# EAGLE design AS91-Rel8TstAd-01 (EAGLE 7.7.0)
DATE_CHECKED: 2020-10-12; DATE_DRAWN: 2020-10-11; DATE_RELEASED: 2020-10-12; DRAWING_NUMBER: ASR_HW0026_REL8TSTAD_XXX_DRW_A; GLOBAL_TITLE: Generic Relay Test Adapter with 8 Relays; NAME_CHECKED: A. Schröder; NAME_DRAWN: A. Lindmeier; NAME_RELEASED: G. Hemmel; PROJECT_NAME: Rel8TstAd; PROJECT_NUMBER: HW0026; REV: 01; SUB_TITLE: Relay Box with ATXMEGA
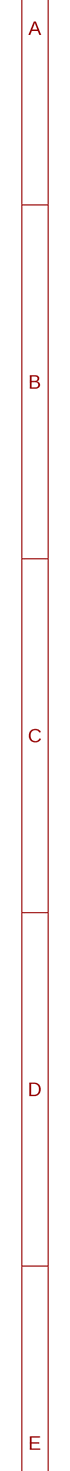
[diagram p0: schematic, sheet 1, part 1 of 2]
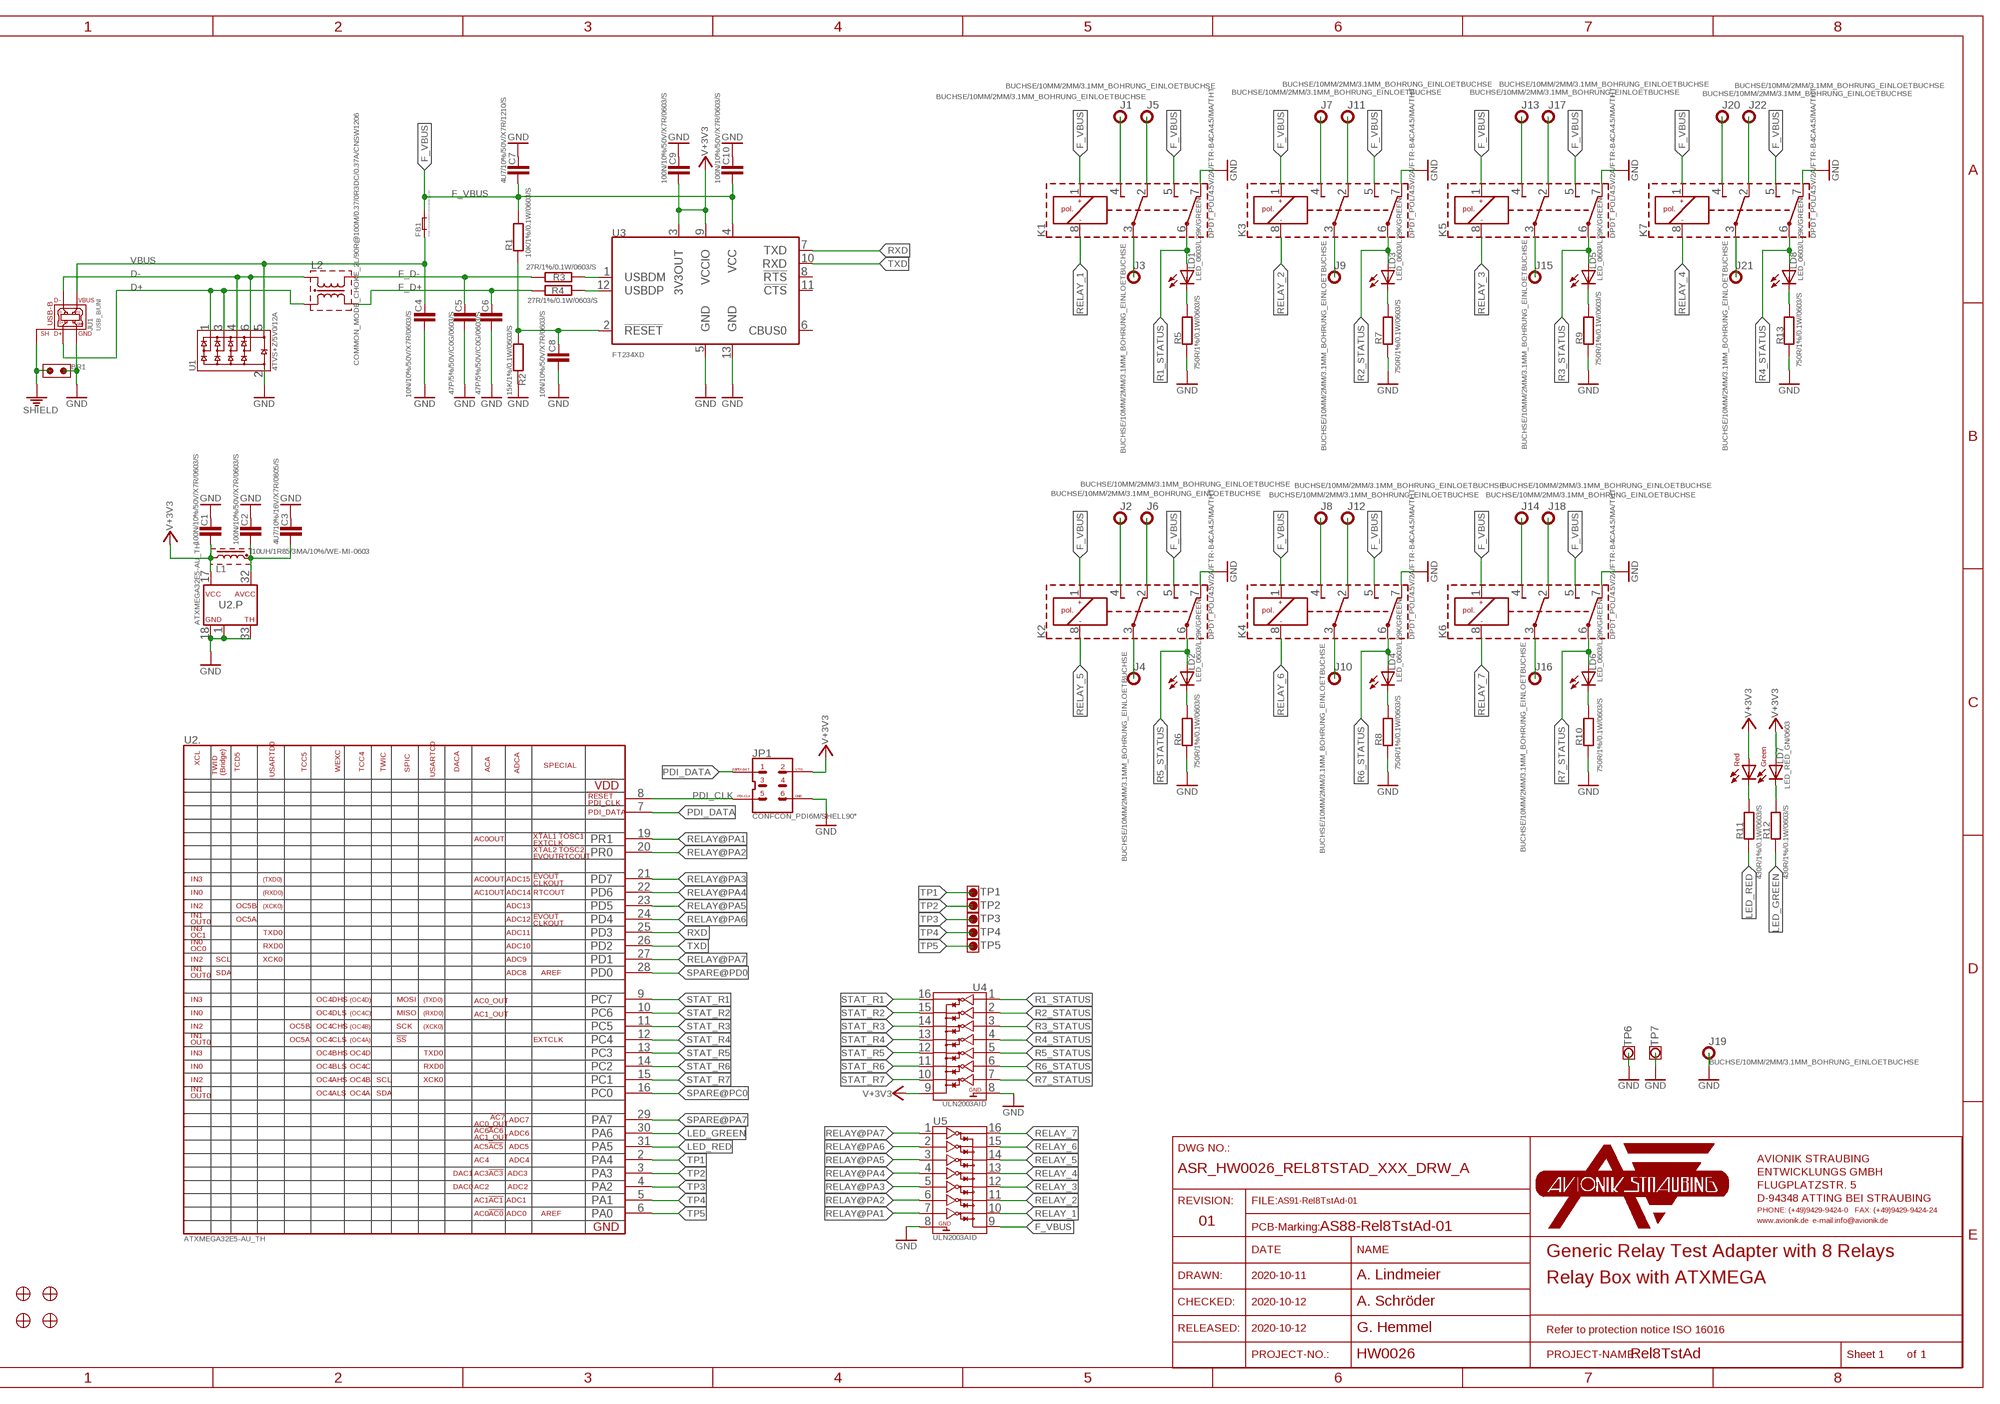
[diagram p1: schematic, sheet 1, part 2 of 2]

## Parts
BR1  BRIDGE_OPEN/SOLDER  [SOLDER_OPEN]
C1  100N/10%/50V/X7R/0603/S  [C0603_STD]
C2  100N/10%/50V/X7R/0603/S  [C0603_STD]
C3  4U7/10%/16V/X7R/0805/S  [C0805_STD]
C4  10N/10%/50V/X7R/0603/S  [C0603_STD]
C5  47P/5%/50V/C0G/0603/S  [C0603_STD]
C6  47P/5%/50V/C0G/0603/S  [C0603_STD]
C7  4U7/10%/50V/X7R/1210/S  [C1210_STD]
C8  10N/10%/50V/X7R/0603/S  [C0603_STD]
C9  100N/10%/50V/X7R/0603/S  [C0603_STD]
C10  100N/10%/50V/X7R/0603/S  [C0603_STD]
DRAWING_FRAME1  DIN_A3LOC_PCBMARK_ASR/TOP/STOP/0.8  [FRAME_REVISION_TOP_STOP_0.8]
FB1  FB/WE-CBF/742792620/DC0R15/0.5A/WE/CBF0603  [WE_CBF_0603]
J1  BUCHSE/10MM/2MM/3.1MM_BOHRUNG_EINLOETBUCHSE  [BUCHSE2MM_PCB3.1MMDRILL]
J2  BUCHSE/10MM/2MM/3.1MM_BOHRUNG_EINLOETBUCHSE  [BUCHSE2MM_PCB3.1MMDRILL]
J3  BUCHSE/10MM/2MM/3.1MM_BOHRUNG_EINLOETBUCHSE  [BUCHSE2MM_PCB3.1MMDRILL]
J4  BUCHSE/10MM/2MM/3.1MM_BOHRUNG_EINLOETBUCHSE  [BUCHSE2MM_PCB3.1MMDRILL]
J5  BUCHSE/10MM/2MM/3.1MM_BOHRUNG_EINLOETBUCHSE  [BUCHSE2MM_PCB3.1MMDRILL]
J6  BUCHSE/10MM/2MM/3.1MM_BOHRUNG_EINLOETBUCHSE  [BUCHSE2MM_PCB3.1MMDRILL]
J7  BUCHSE/10MM/2MM/3.1MM_BOHRUNG_EINLOETBUCHSE  [BUCHSE2MM_PCB3.1MMDRILL]
J8  BUCHSE/10MM/2MM/3.1MM_BOHRUNG_EINLOETBUCHSE  [BUCHSE2MM_PCB3.1MMDRILL]
J9  BUCHSE/10MM/2MM/3.1MM_BOHRUNG_EINLOETBUCHSE  [BUCHSE2MM_PCB3.1MMDRILL]
J10  BUCHSE/10MM/2MM/3.1MM_BOHRUNG_EINLOETBUCHSE  [BUCHSE2MM_PCB3.1MMDRILL]
J11  BUCHSE/10MM/2MM/3.1MM_BOHRUNG_EINLOETBUCHSE  [BUCHSE2MM_PCB3.1MMDRILL]
J12  BUCHSE/10MM/2MM/3.1MM_BOHRUNG_EINLOETBUCHSE  [BUCHSE2MM_PCB3.1MMDRILL]
J13  BUCHSE/10MM/2MM/3.1MM_BOHRUNG_EINLOETBUCHSE  [BUCHSE2MM_PCB3.1MMDRILL]
J14  BUCHSE/10MM/2MM/3.1MM_BOHRUNG_EINLOETBUCHSE  [BUCHSE2MM_PCB3.1MMDRILL]
J15  BUCHSE/10MM/2MM/3.1MM_BOHRUNG_EINLOETBUCHSE  [BUCHSE2MM_PCB3.1MMDRILL]
J16  BUCHSE/10MM/2MM/3.1MM_BOHRUNG_EINLOETBUCHSE  [BUCHSE2MM_PCB3.1MMDRILL]
J17  BUCHSE/10MM/2MM/3.1MM_BOHRUNG_EINLOETBUCHSE  [BUCHSE2MM_PCB3.1MMDRILL]
J18  BUCHSE/10MM/2MM/3.1MM_BOHRUNG_EINLOETBUCHSE  [BUCHSE2MM_PCB3.1MMDRILL]
J19  BUCHSE/10MM/2MM/3.1MM_BOHRUNG_EINLOETBUCHSE  [BUCHSE2MM_PCB3.1MMDRILL]
J20  BUCHSE/10MM/2MM/3.1MM_BOHRUNG_EINLOETBUCHSE  [BUCHSE2MM_PCB3.1MMDRILL]
J21  BUCHSE/10MM/2MM/3.1MM_BOHRUNG_EINLOETBUCHSE  [BUCHSE2MM_PCB3.1MMDRILL]
J22  BUCHSE/10MM/2MM/3.1MM_BOHRUNG_EINLOETBUCHSE  [BUCHSE2MM_PCB3.1MMDRILL]
JP1  CONFCON_PDI6M/SHELL90°  [PH2X3_WSL_SHELL_90°]
JU1  USB_B/UNI  [USB-B-BUCHSE-LP]
K1  DPDT_POL/4.5V/2A/FTR-B4CA4.5/MA/THT  [FTR-B4]
K2  DPDT_POL/4.5V/2A/FTR-B4CA4.5/MA/THT  [FTR-B4]
K3  DPDT_POL/4.5V/2A/FTR-B4CA4.5/MA/THT  [FTR-B4]
K4  DPDT_POL/4.5V/2A/FTR-B4CA4.5/MA/THT  [FTR-B4]
K5  DPDT_POL/4.5V/2A/FTR-B4CA4.5/MA/THT  [FTR-B4]
K6  DPDT_POL/4.5V/2A/FTR-B4CA4.5/MA/THT  [FTR-B4]
K7  DPDT_POL/4.5V/2A/FTR-B4CA4.5/MA/THT  [FTR-B4]
L1  10UH/1R85/3MA/10%/WE-MI-0603  [WE-MI_0603]
L2  COMMON_MODE_CHOKE_2L/90R@100M/0.37/0R3DC/0.37A/CNSW1206  [WUERTH_CNSW_1206]
LD1  LED_0603/L29K/GREEN  [CHIPLED0603SMALL]
LD2  LED_0603/L29K/GREEN  [CHIPLED0603SMALL]
LD3  LED_0603/L29K/GREEN  [CHIPLED0603SMALL]
LD4  LED_0603/L29K/GREEN  [CHIPLED0603SMALL]
LD5  LED_0603/L29K/GREEN  [CHIPLED0603SMALL]
LD6  LED_0603/L29K/GREEN  [CHIPLED0603SMALL]
LD7  LED_RED_GN/0603  [DUOLED_0603]
LD8  LED_0603/L29K/GREEN  [CHIPLED0603SMALL]
PCB1  TEKO_MOD_P2  [BOARD_TEKO_MOD_P2_UP]
R1  10K/1%/0.1W/0603/S  [R0603_STD]
R2  15K/1%/0.1W/0603/S  [R0603_STD]
R3  27R/1%/0.1W/0603/S  [R0603_STD]
R4  27R/1%/0.1W/0603/S  [R0603_STD]
R5  750R/1%/0.1W/0603/S  [R0603_STD]
R6  750R/1%/0.1W/0603/S  [R0603_STD]
R7  750R/1%/0.1W/0603/S  [R0603_STD]
R8  750R/1%/0.1W/0603/S  [R0603_STD]
R9  750R/1%/0.1W/0603/S  [R0603_STD]
R10  750R/1%/0.1W/0603/S  [R0603_STD]
R11  430R/1%/0.1W/0603/S  [R0603_STD]
R12  430R/1%/0.1W/0603/S  [R0603_STD]
R13  750R/1%/0.1W/0603/S  [R0603_STD]
TP1  TESTPAD_ROUND/1.0MM  [TP_ROUND_SMD_1MM]
TP2  TESTPAD_ROUND/1.0MM  [TP_ROUND_SMD_1MM]
TP3  TESTPAD_ROUND/1.0MM  [TP_ROUND_SMD_1MM]
TP4  TESTPAD_ROUND/1.0MM  [TP_ROUND_SMD_1MM]
TP5  TESTPAD_ROUND/1.0MM  [TP_ROUND_SMD_1MM]
TP6  TESTPOINT_1/OCT_0.8  [TP_OCT_0.8_DRILL]
TP7  TESTPOINT_1/OCT_0.8  [TP_OCT_0.8_DRILL]
U1  4TVS+Z/5V0/12A  [SOT23-6L]
U2  ATXMEGA32E5-AU_TH  [TQFP32A_THGND]
U3  FT234XD  [FT234XD]
U4  ULN2003AID  [SO16]
U5  ULN2003AID  [SO16]

## Nets
D+: JU1.3(D+) L2.1(L2_A) U1.1(IO1) U1.3(IO2)
D-: JU1.2(D-) L2.4(L1_A) U1.4(IO3) U1.6(IO4)
F_D+: C6.1 L2.2(L2_B) R4.1
F_D-: C5.1 L2.3(L1_B) R3.1
F_VBUS: C7.2 C10.2 FB1.2 K1.1(K+) K1.5(NO2) K2.1(K+) K2.5(NO2) K3.1(K+) K3.5(NO2) K4.1(K+) K4.5(NO2) K5.1(K+) K5.5(NO2) K6.1(K+) K6.5(NO2) K7.1(K+) K7.5(NO2) R1.2 U3.4(VCC) U5.9(CFW)
GND: BR1.CENT C1.1 C2.1 C3.1 C4.2 C5.2 C6.2 C7.1 C8.2 C9.1 C10.1 J19.1 JP1.6(GND) JU1.4(GND) K1.7(NC2) K2.7(NC2) K3.7(NC2) K4.7(NC2) K5.7(NC2) K6.7(NC2) K7.7(NC2) R2.1 R5.1 R6.1 R7.1 R8.1 R9.1 R10.1 R13.1 TP6.A TP7.A U1.2(GND) U2.1(.P:GND) U2.18(.P:GND) U2.33(.P:GND) U3.5(GND) U3.13(GND) U4.8(GND) U5.8(GND)
LED_GREEN: R12.1 U2.30(.:PA6)
LED_RED: R11.1 U2.31(.:PA5)
N$1: J7.1 K3.4(NO1)
N$3: J11.1 K3.2(NC1)
N$4: J1.1 K1.4(NO1)
N$5: J9.1 K3.3(COM1)
N$6: J13.1 K5.4(NO1)
N$7: J17.1 K5.2(NC1)
N$8: J15.1 K5.3(COM1)
N$9: J20.1 K7.4(NO1)
N$12: LD7.3(C_GN) R12.2
N$13: R3.2 U3.1(USBDM)
N$14: R4.2 U3.12(USBDP)
N$15: J2.1 K2.4(NO1)
N$16: J5.1 K1.2(NC1)
N$17: C8.1 R1.1 R2.2 U3.2(!RESET)
N$18: LD7.4(C_RED) R11.2
N$19: J3.1 K1.3(COM1)
N$20: J22.1 K7.2(NC1)
N$21: J21.1 K7.3(COM1)
N$23: J6.1 K2.2(NC1)
N$24: J4.1 K2.3(COM1)
N$25: J8.1 K4.4(NO1)
N$26: J12.1 K4.2(NC1)
N$27: J10.1 K4.3(COM1)
N$28: J14.1 K6.4(NO1)
N$29: J18.1 K6.2(NC1)
N$30: J16.1 K6.3(COM1)
N$36: LD1.C R5.2
N$37: LD3.C R7.2
N$38: LD5.C R9.2
N$39: LD8.C R13.2
N$40: LD6.C R10.2
N$41: LD4.C R8.2
N$42: LD2.C R6.2
N$50: C2.2 C3.2 L1.1 U2.32(.P:AVCC)
PDI_CLK: JP1.5(PDI_CLK) U2.8(.:PDI_CLK/!RESET)
PDI_DATA: JP1.1(PDI_DATA) U2.7(.:PDI_DATA)
R1_STATUS: K1.6(COM2) LD1.A U4.1(IN1)
R2_STATUS: K3.6(COM2) LD3.A U4.2(IN2)
R3_STATUS: K5.6(COM2) LD5.A U4.3(IN3)
R4_STATUS: K7.6(COM2) LD8.A U4.4(IN4)
R5_STATUS: K2.6(COM2) LD2.A U4.5(IN5)
R6_STATUS: K4.6(COM2) LD4.A U4.6(IN6)
R7_STATUS: K6.6(COM2) LD6.A U4.7(IN7)
RELAY@PA1: U2.19(.:PR1) U5.7(IN7)
RELAY@PA2: U2.20(.:PR0) U5.6(IN6)
RELAY@PA3: U2.21(.:PD7) U5.5(IN5)
RELAY@PA4: U2.22(.:PD6) U5.4(IN4)
RELAY@PA5: U2.23(.:PD5) U5.3(IN3)
RELAY@PA6: U2.24(.:PD4) U5.2(IN2)
RELAY@PA7: U2.27(.:PD1) U5.1(IN1)
RELAY_1: K1.8(K-) U5.10(OUT7)
RELAY_2: K3.8(K-) U5.11(OUT6)
RELAY_3: K5.8(K-) U5.12(OUT5)
RELAY_4: K7.8(K-) U5.13(OUT4)
RELAY_5: K2.8(K-) U5.14(OUT3)
RELAY_6: K4.8(K-) U5.15(OUT2)
RELAY_7: K6.8(K-) U5.16(OUT1)
RXD: U2.25(.:PD3) U3.7(TXD)
SHIELD: BR1.A JU1.SH1 JU1.SH2(SH1)
SPARE@PA7: U2.29(.:PA7)
SPARE@PC0: U2.16(.:PC0)
SPARE@PD0: U2.28(.:PD0)
STAT_R1: U2.9(.:PC7) U4.16(OUT1)
STAT_R2: U2.10(.:PC6) U4.15(OUT2)
STAT_R3: U2.11(.:PC5) U4.14(OUT3)
STAT_R4: U2.12(.:PC4) U4.13(OUT4)
STAT_R5: U2.13(.:PC3) U4.12(OUT5)
STAT_R6: U2.14(.:PC2) U4.11(OUT6)
STAT_R7: U2.15(.:PC1) U4.10(OUT7)
TP1: TP1.1 U2.2(.:PA4)
TP2: TP2.1 U2.3(.:PA3)
TP3: TP3.1 U2.4(.:PA2)
TP4: TP4.1 U2.5(.:PA1)
TP5: TP5.1 U2.6(.:PA0)
TXD: U2.26(.:PD2) U3.10(RXD)
V+3V3: C1.2 C9.2 JP1.2(VTG) L1.2 LD7.1(A_GN) LD7.2(A_RED) U2.17(.P:VCC) U3.3(3V3OUT) U3.9(VCCIO) U4.9(CFW)
VBUS: C4.1 FB1.1 JU1.1(VBUS) U1.5(VDD)
Unconnected: PCB1.P$1 PCB1.P$2 PCB1.P$3 PCB1.P$4 U3.6(CBUS0) U3.8(!RTS) U3.11(!CTS)

## Library data of the parts
BR1 = StdConnBridgeJumpers:BRIDGE_OPEN: Bridge, normally open; AVSR-NR: Integral part of PCB
C1 C2 C9 C10 = CapCeramic:100N: Capacitor, 100nF; AVSR-NR: 1C00603-00002; H_MAX: 0.90mm; MFR: Kemet, C0603C104K5RACTU
C3 = CapCeramic:4U7: Capacitor, 4.7 uF; AVSR-NR: 1C00805-00016; H_MAX: 1.40mm; MFR: Kemet, C0805C475K4RACAUTO
C4 C8 = CapCeramic:10N: Capacitor, 10nF; AVSR-NR: 1C00603-00001; H_MAX: 0.90mm; MFR: Kemet, C0603C103K5RACTU
C5 C6 = CapCeramic:47P: Capacitor, 47pF; AVSR-NR: 1C00603-00030; H_MAX: 0.90mm; MFR: Kemet, C0603C470J5GACAUTO
C7 = CapCeramic:4U7: Capacitor, 4.7 uF; AVSR-NR: 1C01210-00004; H_MAX: 2.70mm; MFR: Kemet, C1210X475K5RACTU
DRAWING_FRAME1 = AvsrEntwicklungsGmbHDrawingFrames:DIN_A3LOC_PCBMARK_ASR: A3 drawing frame with location grid and pcb marking field in the document field; PCB_MARKING: AS88-Rel8TstAd-01
FB1 = StdInductorEmiFilters:FB: Ferrit Bead Manufacturer Datasheet Links Würth WE-CBF 742792641 <http://katalog.we-online.de/pbs/datasheet/742792641.pdf> 742792620 <http://katalog.we-online.de/pbs/datasheet/742792620.pdf> Würth WE-CBF Type Wide Band 742792062 <http://katalog.we-online.de/pbs/datasheet/742792062.pdf> Würth WE-CBF Type High Current 742792510 <http://katalog.we-online.de/pbs/datasheet/742792510.pdf> Würth WE-MPSB 74279228260 <http://katalog.we-online.de/pbs/datasheet/74279228260.pdf> 74279221100 <http://katalog.we-online.de/pbs/datasheet/74279221100.pdf>; AVSR-NR: 1L6CBF0-00001; DISTRI: Farnell, 1800350RL; H_MAX: 1.00mm; MFR: Würth, 742792620
J1-J22 = StdConnBananaPlug:BUCHSE: Buchsen; AVSR-NR: 2JR0000-00012; MFR: MC/Stäubli, LB2-D
JP1 = StdMicrocontollerAtmelAT:CONFCON_PDI6M: ATMEL config/debug connector, combined SPI/PDI-Interface; AVSR-NR: 2JPH000-00019; H_MAX: 10 mm; MFR: Molex, 90130-3106
JU1 = StdConnUsb:USB_B; AVSR-NR: 1JP0000-00015; MFR: Amphenol, 61729-0010BLF
K1-K7 = StdElMechRelay:DPDT_POL: Relay, polarized, double pole, double throw (2xUm); AVSR-NR: 1K00000-00001; H_MAX: 9.30 mm; MFR: Fujitsu-Takamisawa, FTR-B4CA4.5
L1 = StdInductors:10UH: Inductor, 10uH; AVSR-NR: 1L0WEMI-00001; MFR: Würth, 7447968
L2 = StdInductorEmiFilters:COMMON_MODE_CHOKE_2L: Current Compensated Chokes; AVSR-NR: 1L3CNSW-00002; H_MAX: 2.00mm; MFR: Würth, 744232090
LD1-LD6 LD8 = StdOptronicLED:LED_0603: LED, 0603 package; AVSR-NR: 1DLED00-00005; H_MAX: 0.90mm; MFR: Osram, LG L29K-F2J1-24-Z
LD7 = StdOptronicLED:LED_RED_GN: Duo-LED, Red/Green; AVSR-NR: 1DLED00-00011; MFR: Broadcom/Avago, HSMF-C165
PCB1 = PS_AVSR_TESTBOXEN:TEKO_MOD_P2; AVSR-NR: 3A00000-00026; MFR: TEKO, P2.10
R1 = StdResistorsFixed:10K: Resistor 10 kOhm; AVSR-NR: 1R00603-00097; H_MAX: 0.5 mm; MFR: Vishay, CRCW060310K0FKEA
R2 = StdResistorsFixed:15K: Resistor 15 kOhm; AVSR-NR: 1R00603-00101; H_MAX: 0.5mm; MFR: Vishay, CRCW060315K0FKEA
R3 R4 = StdResistorsFixed:27R: Resistor 27 Ohm; AVSR-NR: 1R00603-00300; H_MAX: 0.5mm; MFR: Vishay, CRCW060327R0FKEA
R5-R10 R13 = StdResistorsFixed:750R: Resistor 750 Ohm; AVSR-NR: 1R00603-00228; DISTRI: Bürklin, 07E584; H_MAX: 0.5mm
R11 R12 = StdResistorsFixed:430R: Resistor 430 Ohm; AVSR-NR: 1R00603-00064; H_MAX: 0.5mm; MFR: Vishay, CRCW0603430RFKEA
TP1-TP5 = StdConnTestpoints:TESTPAD_ROUND: Testpad, round; AVSR-NR: Integral part of PCB
TP6 TP7 = StdConnTestpoints:TESTPOINT_1: Single Testpoint; AVSR-NR: Integral part of PCB
U1 = StdProtectionDevices:4TVS+Z; AVSR-NR: 1DWETVS-00022; H_MAX: 1.45mm; MFR: Würth, 824015
U2 = StdMicrocontollerAtmelAT:ATXMEGA*E5: Atmel ATxmega E5 series; AVSR-NR: 1U00UC0-00007; H_MAX: 1.20mm; MFR: Microchip/Atmel, ATXMEGA32E5-AU
U3 = StdInterfaceUSB:FT234XD: FT234XS USB to basic UART IC; AVSR-NR: 6P00000-00034; H_MAX: 0.8mm; MFR: FTDI, FT234XD-R
U4 U5 = StdDriverArrays:ULN2003: Driver Array, 7 Drivers, 5V/TTL/CMOS; AVSR-NR: 1U00HC0-00033; H_MAX: 1.75 mm; MFR: TI, ULN2003AID

## Net classes
1 shield: clearance 0.5 mm

## Board
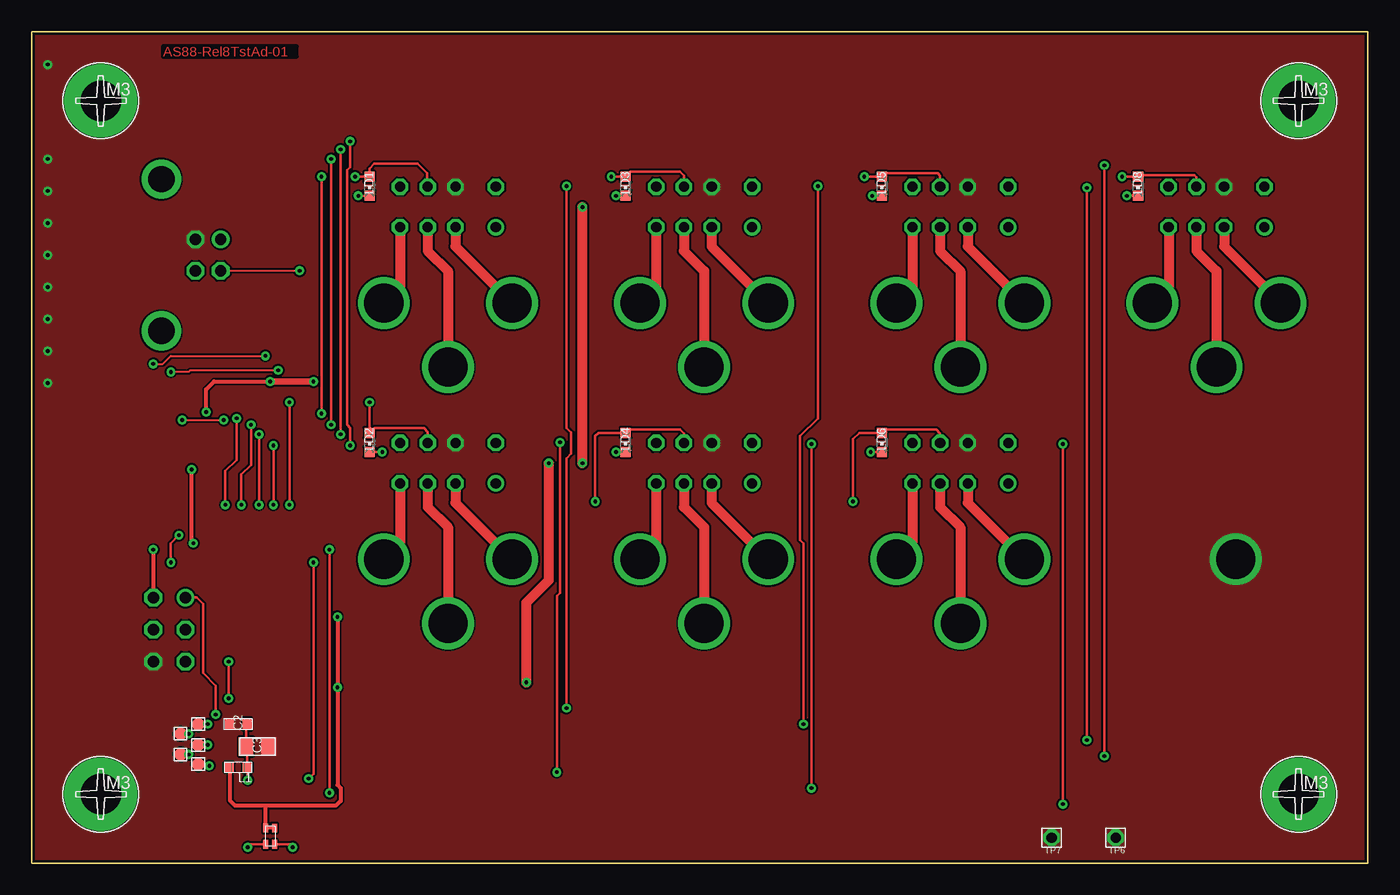
[diagram p2: board, top side]
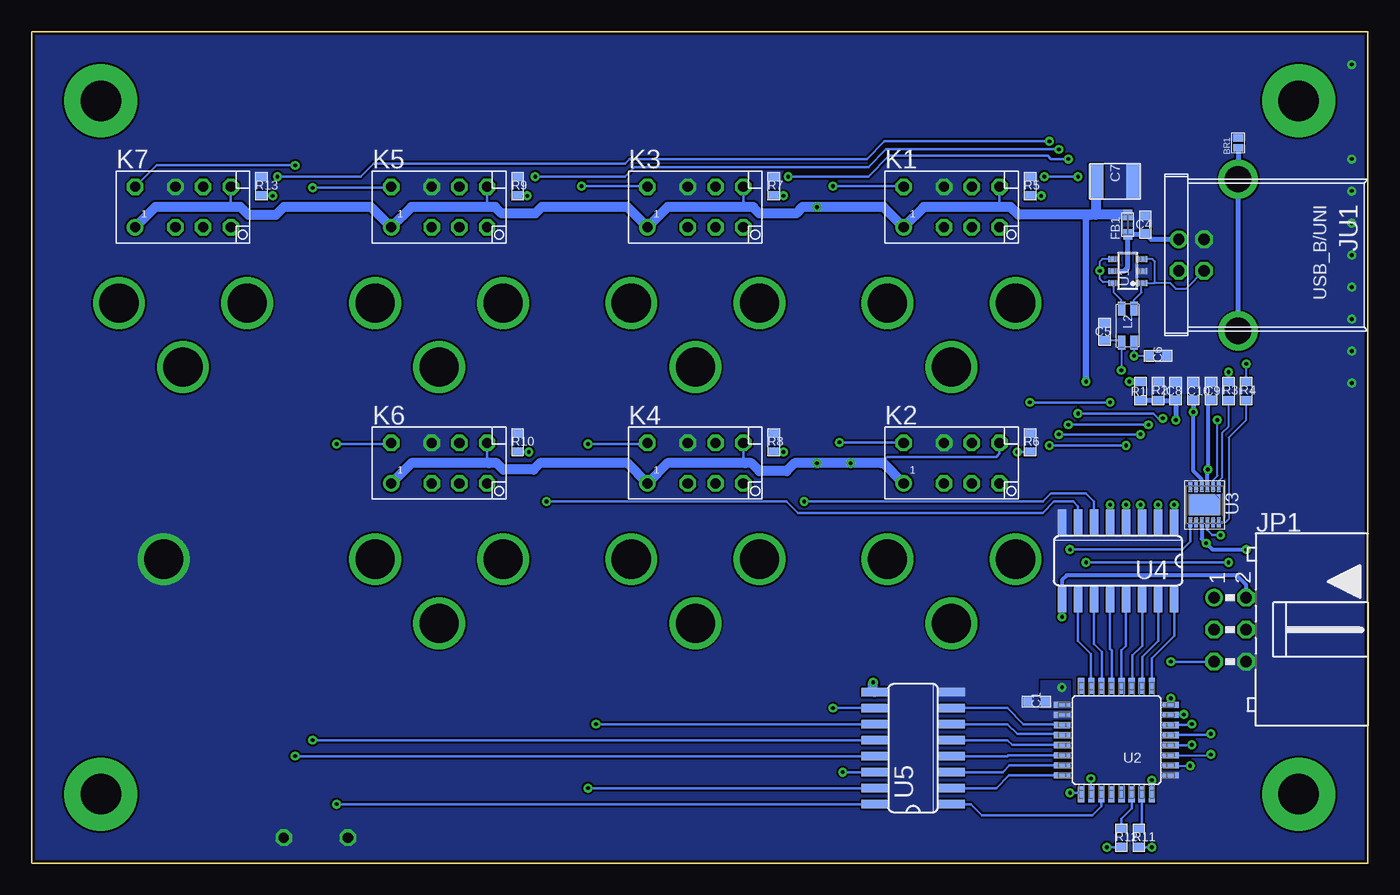
[diagram p3: board, bottom side, seen from below]

Size 106 x 66 mm. Coordinates in mm from the lower left corner, seen from the top.
Copper layers (1*16): Top 0.035mm / dielectric 1.5mm / Bottom 0.035mm
Design rules "BetaLayout_2Layer1.6mm0.3mmSupr": minimum track width 0.15mm, minimum drill 0.3mm, track to track 0.15mm, track to pad 0.15mm, pad to pad 0.15mm, via to via 0.15mm, smd to smd 0.15mm, copper to edge 0.2mm, drill to drill 0.5mm, minimum pad ring 10mil, minimum via ring 8mil, stop-mask expansion 4mil, vias tented up to drill 0.301mm, thermal gap 10mil

### Footprints (pad centres in the part's own frame; a part is rotated, then mirrored left to right if it is on the bottom)
SOLDER_OPEN = smd 0.6 x 0.8: A -0.4,0; CENT 0.4,0
C0603_STD = smd 0.7 x 0.9: 1 -0.7,0; 2 0.7,0
C0805_STD = smd 1.15 x 1.45: 1 -0.9,0; 2 0.9,0
C1210_STD = smd 1.15 x 2.7: 1 -1.5,0; 2 1.5,0
WE_CBF_0603 = smd 0.85 x 0.7: 1 -0.775,0; 2 0.775,0
BUCHSE2MM_PCB3.1MMDRILL = drill 3.1 pad 4.1: 1 0,0
PH2X3_WSL_SHELL_90° = drill 0.9: 1 -2.54,-1.27 | drill 0.9 octagon: 2 -2.54,1.27; 3 0,-1.27; 4 0,1.27; 5 2.54,-1.27; 6 2.54,1.27
USB-B-BUCHSE-LP = drill 0.9: 1 -1.25,-4.71 | drill 0.9 octagon: 2 1.25,-4.71; 3 1.25,-2.71; 4 -1.25,-2.71 | drill 2.1: SH1 -6.02,0; SH2 6.02,0
FTR-B4 = drill 0.8: 1 -3.8,-1.6 | drill 0.8 octagon: 2 -0.6,-1.6; 3 1.6,-1.6; 4 3.8,-1.6; 5 3.8,1.6; 6 1.6,1.6; 7 -0.6,1.6; 8 -3.8,1.6
WE-MI_0603 = smd 0.75 x 0.7: 1 -0.725,0; 2 0.725,0
WUERTH_CNSW_1206 = smd 1.1 x 0.6: 1 -1.35,0.5; 2 1.35,0.5; 3 1.35,-0.5; 4 -1.35,-0.5
CHIPLED0603SMALL = smd 0.8 x 0.8: A 0,-0.75; C 0,0.75
DUOLED_0603 = smd 0.7 x 0.4: 1 -0.65,0.35; 2 -0.65,-0.35; 3 0.65,0.35; 4 0.65,-0.35
BOARD_TEKO_MOD_P2_UP = drill 3.2 pad 5.8: P$1 101,6; P$2 6,61; P$3 6,6; P$4 101,61
R0603_STD = smd 0.7 x 0.9: 1 -0.75,0; 2 0.75,0
TP_ROUND_SMD_1MM = smd 1 x 1: 1 0,0
TP_OCT_0.8_DRILL = drill 0.8 octagon: A 0,0
SOT23-6L = smd 0.5 x 0.9: 1 -0.95,-1.1; 2 0,-1.1; 3 0.95,-1.1; 4 0.95,1.1; 5 0,1.1; 6 -0.95,1.1
TQFP32A_THGND = smd 1.3 x 0.5: 1 -4.3,2.8; 2 -4.3,2; 3 -4.3,1.2; 4 -4.3,0.4; 5 -4.3,-0.4; 6 -4.3,-1.2; 7 -4.3,-2; 8 -4.3,-2.8; 17 4.3,-2.8; 18 4.3,-2; 19 4.3,-1.2; 20 4.3,-0.4; 21 4.3,0.4; 22 4.3,1.2; 23 4.3,2; 24 4.3,2.8; 33 -4.3,2.8 | smd 0.5 x 1.3: 9 -2.8,-4.3; 10 -2,-4.3; 11 -1.2,-4.3; 12 -0.4,-4.3; 13 0.4,-4.3; 14 1.2,-4.3; 15 2,-4.3; 16 2.8,-4.3; 25 2.8,4.3; 26 2,4.3; 27 1.2,4.3; 28 0.4,4.3; 29 -0.4,4.3; 30 -1.2,4.3; 31 -2,4.3; 32 -2.8,4.3
FT234XD = smd 0.8 x 0.3: 1 -1.4,1.125; 2 -1.4,0.675; 3 -1.4,0.225; 4 -1.4,-0.225; 5 -1.4,-0.675; 6 -1.4,-1.125; 7 1.4,-1.125; 8 1.4,-0.675; 9 1.4,-0.225; 10 1.4,0.225; 11 1.4,0.675; 12 1.4,1.125 | smd 1.6 x 2.5: 13 0,0
SO16 = smd 0.66 x 2.032: 1 -4.445,-3.073; 2 -3.175,-3.073; 3 -1.905,-3.073; 4 -0.635,-3.073; 5 0.635,-3.073; 6 1.905,-3.073; 7 3.175,-3.073; 8 4.445,-3.073; 9 4.445,3.073; 10 3.175,3.073; 11 1.905,3.073; 12 0.635,3.073; 13 -0.635,3.073; 14 -1.905,3.073; 15 -3.175,3.073; 16 -4.445,3.073

### Placement (x,y rotation side)
BR1  10.3,57.16 90 bottom
C1  26.3,12.84 0 bottom
C2  16.39,11.06 0 top
C3  17.91,9.28 180 top
C4  17.66,50.68 90 bottom
C5  20.88,42.17 90 bottom
C6  16.64,40.27 0 bottom
C7  20.07,54.11 180 bottom
C8  15.25,37.47 90 bottom
C9  12.45,37.47 270 bottom
C10  13.85,37.47 270 bottom
DRAWING_FRAME1  10.42,64.02 0 top
FB1  19.06,50.68 90 bottom
J1  27.95,44.46 270 top
J2  27.95,24.14 180 top
J3  33.03,39.38 270 top
J4  33.03,19.06 180 top
J5  38.11,44.46 270 top
J6  38.11,24.14 180 top
J7  48.27,44.46 0 top
J8  48.27,24.14 180 top
J9  53.35,39.38 0 top
J10  53.35,19.06 180 top
J11  58.43,44.46 0 top
J12  58.43,24.14 180 top
J13  68.59,44.46 0 top
J14  68.59,24.14 180 top
J15  73.67,39.38 0 top
J16  73.67,19.06 180 top
J17  78.75,44.46 0 top
J18  78.75,24.14 180 top
J19  95.51,24.14 90 top
J20  88.91,44.46 180 top
J21  93.99,39.38 180 top
J22  99.07,44.46 180 top
JP1  10.93,18.55 270 bottom
JU1  10.3,48.27 270 bottom
K1  33.03,52.08 0 bottom
K2  33.03,31.76 0 bottom
K3  53.35,52.08 0 bottom
K4  53.35,31.76 0 bottom
K5  73.67,52.08 0 bottom
K6  73.67,31.76 0 bottom
K7  93.99,52.08 0 bottom
L1  16.39,7.63 180 top
L2  19.06,42.68 270 bottom
LD1  26.8,53.73 180 top
LD2  26.8,33.41 180 top
LD3  47.12,53.73 180 top
LD4  47.12,33.41 180 top
LD5  67.44,53.73 180 top
LD6  67.44,33.41 180 top
LD7  18.93,2.17 270 top
LD8  87.77,53.73 180 top
PCB1  -0.5,-0.5 0 top
R1  18.04,37.47 90 bottom
R2  16.64,37.47 270 bottom
R3  11.06,37.47 270 bottom
R4  9.66,37.47 270 bottom
R5  26.8,53.73 270 bottom
R6  26.8,33.41 270 bottom
R7  47.12,53.73 270 bottom
R8  47.12,33.41 270 bottom
R9  67.44,53.73 270 bottom
R10  67.44,33.41 270 bottom
R11  18.17,2.04 270 bottom
R12  19.57,2.04 270 bottom
R13  87.77,53.73 270 bottom
TP1  13.22,7.88 180 top
TP2  11.82,8.64 180 top
TP3  13.22,9.41 180 top
TP4  11.82,10.3 180 top
TP5  13.22,11.06 180 top
TP6  85.99,2.04 180 top
TP7  80.91,2.04 180 top
U1  19.06,47 90 bottom
U2  19.95,9.79 180 bottom
U3  12.96,28.46 270 bottom
U4  19.82,24.01 180 bottom
U5  36.08,9.15 90 bottom

### Tracks (layer width: path | path; a pad name or v marks a point on that pad's centre or on a via)
D+
  Bottom 0.15: L2.1 18.56,44.7 17.96,45.3 U1.1 16.9,46.05 | U1.3 17.09,47.95 16.9,47.76 16.9,46.05 | 16.9,46.05 15.7,46.05 15.25,45.6 14.42,45.6 JU1.3
D-  (via drill 0.3)
  Top 0.15: JU1.2 v21.26,47.02
  Bottom 0.15: L2.4 19.57,44.71 20.16,45.3 U1.6 20.22,46.11 21.01,46.11 21.26,46.36 v21.26,47.02 21.26,47.76 21.08,47.95 U1.4
F_D+  (via drill 0.3)
  Top 0.15: v9.66,39.63 10.42,39.63 11.06,40.27 v18.55,40.27
  Bottom 0.15: 18.56,41.47 L2.2 v18.55,40.27 C6.1 | R4.1 v9.66,39.63
F_D-  (via drill 0.3)
  Top 0.15: v19.57,39.12 12.58,39.12 12.45,39 v11.06,39
  Bottom 0.15: L2.3 | L2.3 19.57,41.47 C5.1 | L2.3 v19.57,39.12 | v11.06,39 R3.1
F_VBUS  (via drill 0.3)
  Top 0.3: v13.85,35.82 13.85,37.6 14.49,38.23 v18.93,38.23
  Top 0.5: v18.93,38.23 v22.36,38.23
  Top 0.8: v43.7,31.76 v43.7,52.08 | v39.25,14.36 39.25,20.71 41.03,22.49 v41.03,31.76
  Bottom 0.2: 28.33,52.08 29.23,52.08 K1.5 | K3.5 49.55,52.34 49.28,52.08 | K5.5 69.87,52.2 69.98,52.08 | K7.5 90.19,52.09 90.18,52.08 | K2.5 29.23,32.51 29.47,32.27 38.11,32.27 38.62,31.76 | K4.5 49.55,31.89 49.41,31.76 | K6.5 69.87,31.89 69.73,31.76
  Bottom 0.3: U3.4 13.19,30.46 13.85,31.12 v13.85,35.82
  Bottom 0.4: R1.2 18.05,38.23 | C10.2 v13.85,35.82
  Bottom 0.5: 18.05,38.23 v18.93,38.23 | v22.36,38.23 22.36,51.08 21.98,51.46
  Bottom 0.8: FB1.2 21.6,51.46 | C7.2 21.6,54.11 21.6,51.46 | 21.6,51.46 21.98,51.46 27.71,51.46 28.33,52.08 35.23,52.08 K1.1 38.43,52.08 v43.7,52.08 44.84,52.08 45.35,51.57 48.27,51.57 48.78,52.08 49.28,52.08 55.55,52.08 K3.1 58.75,52.08 65.54,52.08 66.05,51.57 68.71,51.57 69.22,52.08 69.98,52.08 75.87,52.08 K5.1 79.07,52.08 85.99,52.08 86.62,51.44 88.78,51.44 89.42,52.08 90.18,52.08 96.19,52.08 K7.1 | K2.1 38.43,31.76 38.62,31.76 v41.03,31.76 v43.7,31.76 45.47,31.76 46.11,31.12 48.27,31.12 48.9,31.76 49.41,31.76 55.55,31.76 K4.1 58.75,31.76 65.67,31.76 66.17,31.25 68.59,31.25 69.1,31.76 69.73,31.76 75.87,31.76 K6.1 | U5.9 39.25,13.7 v39.25,14.36
GND  (via drill 0.3)
  other vias: 1.28,38.11 1.28,63.38 1.28,48.27 1.28,45.73 1.28,43.19 1.28,40.65 1.28,50.81 1.28,53.35 1.28,55.89
  pour Bottom (rank 5, no thermals): 105.99,-0.01 105.99,65.99 -0.01,65.99 -0.01,-0.01
  pour Top (rank 5, no thermals): -0.01,-0.01 -0.01,65.99 105.99,65.99 105.99,-0.01
LED_GREEN
  Bottom 0.2: U2.30 18.75,4.38 19.57,3.56 R12.1
LED_RED
  Bottom 0.2: U2.31 17.95,3.01 R11.1
N$1
  Top 0.8: K3.4 49.55,45.74 J7.1
N$3
  Top 0.8: K3.2 53.95,48.94 J11.1
N$4
  Top 0.8: K1.4 29.23,45.74 J1.1
N$5
  Top 0.8: K3.3 51.75,48.6 53.35,47 J9.1
N$6
  Top 0.8: K5.4 69.87,45.74 J13.1
N$7
  Top 0.8: K5.2 74.27,48.94 J17.1
N$8
  Top 0.8: K5.3 72.07,48.6 73.67,47 J15.1
N$9
  Top 0.8: K7.4 90.19,45.74 J20.1
N$12  (via drill 0.3)
  Top 0.2: LD7.3 20.47,1.52 v20.71,1.28
  Bottom 0.2: v20.71,1.28 R12.2
N$13
  Bottom 0.15: U3.1 11.84,30.34 11.57,30.61 11.57,34.17 11.06,34.68 R3.2
N$14
  Bottom 0.15: R4.2 9.66,35.19 11.06,33.79 11.06,27.31 11.31,27.06 U3.12
N$15
  Top 0.8: K2.4 29.23,25.42 J2.1
N$16
  Top 0.8: K1.2 33.63,48.94 J5.1
N$17  (via drill 0.3)
  Top 0.15: v11.95,35.19 v15.25,35.19
  Bottom 0.15: U3.2 12.29,30.4 11.95,30.74 v11.95,35.19 | 15.3,36.72 C8.1
  Bottom 0.4: C8.1 v15.25,35.19 | R1.1 R2.2 15.3,36.72
N$18  (via drill 0.3)
  Top 0.2: LD7.4 17.39,1.52 v17.15,1.28
  Bottom 0.2: v17.15,1.28 R11.2
N$19
  Top 0.8: K1.3 31.43,48.6 33.03,47 J3.1
N$20
  Top 0.8: K7.2 94.59,48.94 J22.1
N$21
  Top 0.8: K7.3 92.39,48.6 93.99,47 J21.1
N$23
  Top 0.8: K2.2 33.63,28.62 J6.1
N$24
  Top 0.8: K2.3 31.43,28.28 33.03,26.68 J4.1
N$25
  Top 0.8: K4.4 49.55,25.42 J8.1
N$26
  Top 0.8: K4.2 53.95,28.62 J12.1
N$27
  Top 0.8: K4.3 51.75,28.28 53.35,26.68 J10.1
N$28
  Top 0.8: K6.4 69.87,25.42 J14.1
N$29
  Top 0.8: K6.2 74.27,28.62 J18.1
N$30
  Top 0.8: K6.3 72.07,28.28 73.67,26.68 J16.1
N$36  (via drill 0.3)
  Top 0.15: v25.92,52.97 R5.2
  Bottom 0.15: R5.2 v25.92,52.98 v25.92,52.97
N$37  (via drill 0.3)
  Top 0.2: R7.2 46.38,52.98 v46.36,52.97
  Bottom 0.2: v46.36,52.97 47.11,52.97 R7.2
N$38  (via drill 0.3)
  Top 0.2: R9.2 66.69,52.98 v66.68,52.97
  Bottom 0.2: v66.68,52.97 67.43,52.97 R9.2
N$39  (via drill 0.3)
  Top 0.2: v86.88,52.97 87.75,52.97 R13.2
  Bottom 0.2: R13.2 v86.89,52.98 v86.88,52.97
N$40  (via drill 0.3)
  Top 0.2: v66.56,32.65 67.43,32.65 R10.2
  Bottom 0.2: R10.2 66.57,32.66 v66.56,32.65
N$41  (via drill 0.3)
  Top 0.2: v46.36,32.65 47.11,32.65 R8.2
  Bottom 0.2: R8.2 46.38,32.66 v46.36,32.65
N$42  (via drill 0.3)
  Top 0.2: R6.2 v27.82,32.65
  Bottom 0.2: v27.82,32.65 R6.2
N$50  (via drill 0.3)
  Top 0.2: v17.15,6.61 17.15,7.59 L1.1 17.12,9.18 C3.2 17.04,9.3 17.04,11 C2.2
  Bottom 0.2: U2.32 v17.15,6.61
PDI_CLK  (via drill 0.3)
  Top 0.2: v15.63,16.01 v15.63,13.09
  Bottom 0.2: JP1.5 v15.63,16.01 | v15.63,13.09 15.63,12.61 U2.8
PDI_DATA  (via drill 0.3)
  Top 0.2: JP1.1 13.09,21.09 13.6,20.58 13.6,15.12 14.61,14.11 v14.61,11.82
  Bottom 0.2: v14.61,11.82 15.61,11.82 U2.7
R1_STATUS  (via drill 0.3)
  Top 0.2: K1.6 31.38,53.73 31.38,54.75 30.61,55.51 27.19,55.51 26.8,55.13 LD1.A 25.67,54.48 v25.66,54.49 | v22.99,54.49 v22.99,35.7 | v16.26,35.31 16.26,32.01 15.38,31.12 v15.38,28.46
  Bottom 0.2: v22.99,35.7 17.03,35.7 16.64,35.31 v16.26,35.31 | v15.38,28.46 U4.1 | v25.66,54.49 v22.99,54.49
R2_STATUS  (via drill 0.3)
  Top 0.2: K3.6 51.75,54.57 51.44,54.87 47.52,54.87 LD3.A 45.99,54.48 v45.98,54.49 | v23.76,55.89 v23.76,34.81 | v17.41,34.81 17.41,31.63 16.64,30.87 v16.64,28.46
  Bottom 0.2: v45.98,54.49 39.63,54.49 37.98,56.14 25.41,56.14 25.15,55.89 v23.76,55.89 | v23.76,34.81 v17.41,34.81 | v16.64,28.46 U4.2
R3_STATUS  (via drill 0.3)
  Top 0.2: K5.6 72.07,54.57 71.89,54.75 67.71,54.75 LD5.A 66.06,54.48 v66.05,54.49 | v24.52,56.65 v24.52,34.04 | v18.04,34.04 v18.04,28.46
  Bottom 0.2: v66.05,54.49 58.94,54.49 58.17,55.25 39.63,55.25 38.23,56.65 v24.52,56.65 | v24.52,34.04 v18.04,34.04 | v18.04,28.46 18.04,27.21 U4.3
R4_STATUS  (via drill 0.3)
  Top 0.2: K7.6 92.39,54.44 92.21,54.62 87.9,54.62 LD8.A v86.51,54.48 v86.49,54.49 | v25.28,57.29 25.28,55.25 25.03,55 25.03,34.81 25.28,34.55 v25.28,33.16 | v19.18,33.16 v19.18,28.46
  Bottom 0.2: v86.49,54.49 79.89,54.49 78.88,55.51 58.94,55.51 58.55,55.89 39.76,55.89 38.36,57.29 v25.28,57.29 | v25.28,33.16 v19.18,33.16 | v19.18,28.46 U4.4
R5_STATUS  (via drill 0.3)
  Top 0.2: v26.8,36.58 LD2.A 27.2,34.55 31.12,34.55 31.43,34.25 K2.6 | v20.45,36.58 v20.45,28.46
  Bottom 0.2: v26.8,36.58 v20.45,36.58 | v20.45,28.46 U4.5
R6_STATUS  (via drill 0.3)
  Top 0.2: K4.6 51.75,34.12 51.44,34.43 47.39,34.43 LD4.A 44.95,34.16 44.71,33.92 v44.71,28.71
  Bottom 0.2: v44.71,28.71 25.79,28.71 25.15,29.34 22.36,29.34 21.72,28.71 U4.6
R7_STATUS  (via drill 0.3)
  Top 0.2: K6.6 72.07,34.12 71.76,34.43 67.71,34.43 LD6.A 65.66,34.16 65.16,33.66 v65.16,28.71
  Bottom 0.2: v65.16,28.71 46.11,28.71 45.22,27.82 25.79,27.82 24.9,28.71 23.38,28.71 22.99,28.33 U4.7
RELAY@PA1
  Bottom 0.2: U5.7 28.58,12.33 27.31,11.06 24.32,11.06 U2.19
RELAY@PA2
  Bottom 0.2: U5.6 28.58,11.06 27.82,10.3 24.36,10.3 U2.20
RELAY@PA3
  Bottom 0.2: U5.5 28.58,9.79 28.2,9.41 24.27,9.41 U2.21
RELAY@PA4
  Bottom 0.2: U2.22 28.51,8.59 28.58,8.52 U5.4
RELAY@PA5
  Bottom 0.2: U2.23 28.42,7.79 28.96,7.25 U5.3
RELAY@PA6
  Bottom 0.2: U2.24 28.46,6.99 29.47,5.98 U5.2
RELAY@PA7
  Bottom 0.2: U2.27 21.15,4.52 21.85,3.82 30.61,3.82 31.5,4.71 U5.1
RELAY_1  (via drill 0.3)
  Top 0.2: v42.43,53.73 42.43,34.55 42.81,34.17 42.81,32.52 42.43,32.14 v42.43,12.33
  Bottom 0.2: v42.43,12.33 U5.10 | K1.8 36.88,53.73 v42.43,53.73
RELAY_2  (via drill 0.3)
  Top 0.2: v62.37,53.73 62.37,35.31 60.97,33.92 60.97,25.66 61.22,25.41 v61.22,11.06
  Bottom 0.2: K3.8 57.15,53.73 v62.37,53.73 | v61.22,11.06 U5.11
RELAY_3  (via drill 0.3)
  Top 0.2: v83.7,53.6 v83.7,9.79
  Bottom 0.2: K5.8 77.54,53.6 v83.7,53.6 | v83.7,9.79 U5.12
RELAY_4  (via drill 0.3)
  Top 0.2: v85.1,55.38 v85.1,8.52
  Bottom 0.2: K7.8 96.09,55.38 v85.1,55.38 | v85.1,8.52 U5.13
RELAY_5  (via drill 0.3)
  Top 0.2: v41.92,33.41 41.92,21.47 41.66,21.22 v41.66,7.25
  Bottom 0.2: v41.66,7.25 U5.14 | K2.8 36.88,33.41 v41.92,33.41
RELAY_6  (via drill 0.3)
  Top 0.2: v61.86,33.28 v61.86,5.98
  Bottom 0.2: K4.8 57.22,33.28 v61.86,33.28 | v61.86,5.98 U5.15
RELAY_7  (via drill 0.3)
  Top 0.2: v81.8,33.28 v81.8,4.71
  Bottom 0.2: K6.8 77.54,33.28 v81.8,33.28 | v81.8,4.71 U5.16
RXD  (via drill 0.3)
  Top 0.2: v23.63,24.9 v23.63,5.6
  Bottom 0.2: U3.7 14.09,25.55 14.74,24.9 v23.63,24.9 | v23.63,5.6 22.86,5.6 U2.25
SHIELD
  Bottom 0.4: JU1.SH2 JU1.SH1 BR1.A
STAT_R1
  Bottom 0.2: U4.16 15.38,18.04 17.15,16.26 U2.9
STAT_R2
  Bottom 0.2: U4.15 16.64,17.66 17.91,16.39 17.91,14.12 U2.10
STAT_R3
  Bottom 0.2: U4.14 17.91,17.28 18.68,16.52 18.68,14.16 U2.11
STAT_R4
  Bottom 0.2: U4.13 19.18,17.28 19.57,16.9 19.57,14.11 U2.12
STAT_R5
  Bottom 0.2: U4.12 20.45,17.03 20.33,16.9 20.33,14.11 U2.13
STAT_R6
  Bottom 0.2: U4.11 21.72,17.41 21.09,16.77 21.09,14.14 U2.14
STAT_R7
  Bottom 0.2: U4.10 22.99,17.66 21.98,16.64 21.98,14.12 U2.15
TP1  (via drill 0.3)
  Top 0.15: v14.11,7.75 13.34,7.75 TP1.1
  Bottom 0.15: U2.2 15.65,7.75 v14.11,7.75
TP2  (via drill 0.3)
  Top 0.15: v12.45,8.64 TP2.1
  Bottom 0.15: U2.3 12.51,8.59 v12.45,8.64
TP3  (via drill 0.3)
  Top 0.2: v13.98,9.41 TP3.1
  Bottom 0.2: U2.4 14,9.39 v13.98,9.41
TP4  (via drill 0.3)
  Top 0.2: v12.45,10.3 TP4.1
  Bottom 0.2: U2.5 12.56,10.19 v12.45,10.3
TP5  (via drill 0.3)
  Top 0.2: v13.98,11.06 TP5.1
  Bottom 0.2: U2.6 14.05,10.99 v13.98,11.06
TXD  (via drill 0.3)
  Top 0.2: v11.69,26.04 11.06,25.41 v11.06,23.88 | v22.36,23.88 22.36,7.12 v21.98,6.74
  Bottom 0.2: U3.10 12.74,26.45 12.33,26.04 v11.69,26.04 | v11.06,23.88 v22.36,23.88 | v21.98,6.74 21.98,5.52 U2.26
V+3V3  (via drill 0.3)
  Top 0.3: v12.84,25.41 12.71,25.54 v12.71,31.25 | v9.66,24.9 JP1.2 | v24.27,19.57 v24.27,13.98 24.27,6.23 24.52,5.98 24.52,4.96 24.14,4.58 18.55,4.58 | 18.55,4.58 16.14,4.58 15.76,4.96 15.76,7.54 L1.2 | 18.55,4.58 18.58,4.55 LD7.2 LD7.1
  Bottom 0.2: C9.2 12.71,36.52
  Bottom 0.3: 12.71,36.52 v12.71,31.25 12.74,31.22 U3.3 | U3.9 13.19,25.76 v12.84,25.41 12.33,24.9 v9.66,24.9 | v24.27,19.57 U4.9 24.27,22.49 23.88,22.87 10.42,22.87 9.66,22.11 JP1.2
  pour Bottom (rank 2, no thermals): 23.63,14.49 23.63,12.33 25.92,12.33 25.92,14.49
VBUS
  Bottom 0.15: C4.1 17.74,49.91
  Bottom 0.4: U1.5 19.31,47 19.06,47.25 FB1.1 17.74,49.91 | C4.1 17.2,49.52 JU1.1

### Text on the board
tStop: R1_ON | RELAY 1 | RELAY 2 | RELAY 3 | RELAY 4 | R1_ON | R2_ON | R3_ON | R4_ON | USB | NO | NC | NO | NC | NO | NC | NO | NC | IN | IN | IN | IN | RELAY 5 | RELAY 6 | RELAY 7 | R5_ON | R6_ON | R7_ON | NO | NC | NO | NC | NO | NC | GND | PDI | IN | IN | IN | 5 | 4 | 2 | 3 | 1 | LED_R | LED_G | GND